# Altium schematic sheet MB1296-Power.SchDoc: Power
size A4; Date: 25-JAN-2017; Organization: STMicroelectronics; Address1: Microcontrollers Division; Address2: 190, avenue Célestin COQ; Address3: 13106 ROUSSET Cedex; Address4: FRANCE; DocumentNumber: MB1296; Revision: D-01; SheetNumber: 2; SheetTotal: 6; Project: STM32 LoRa Discovery
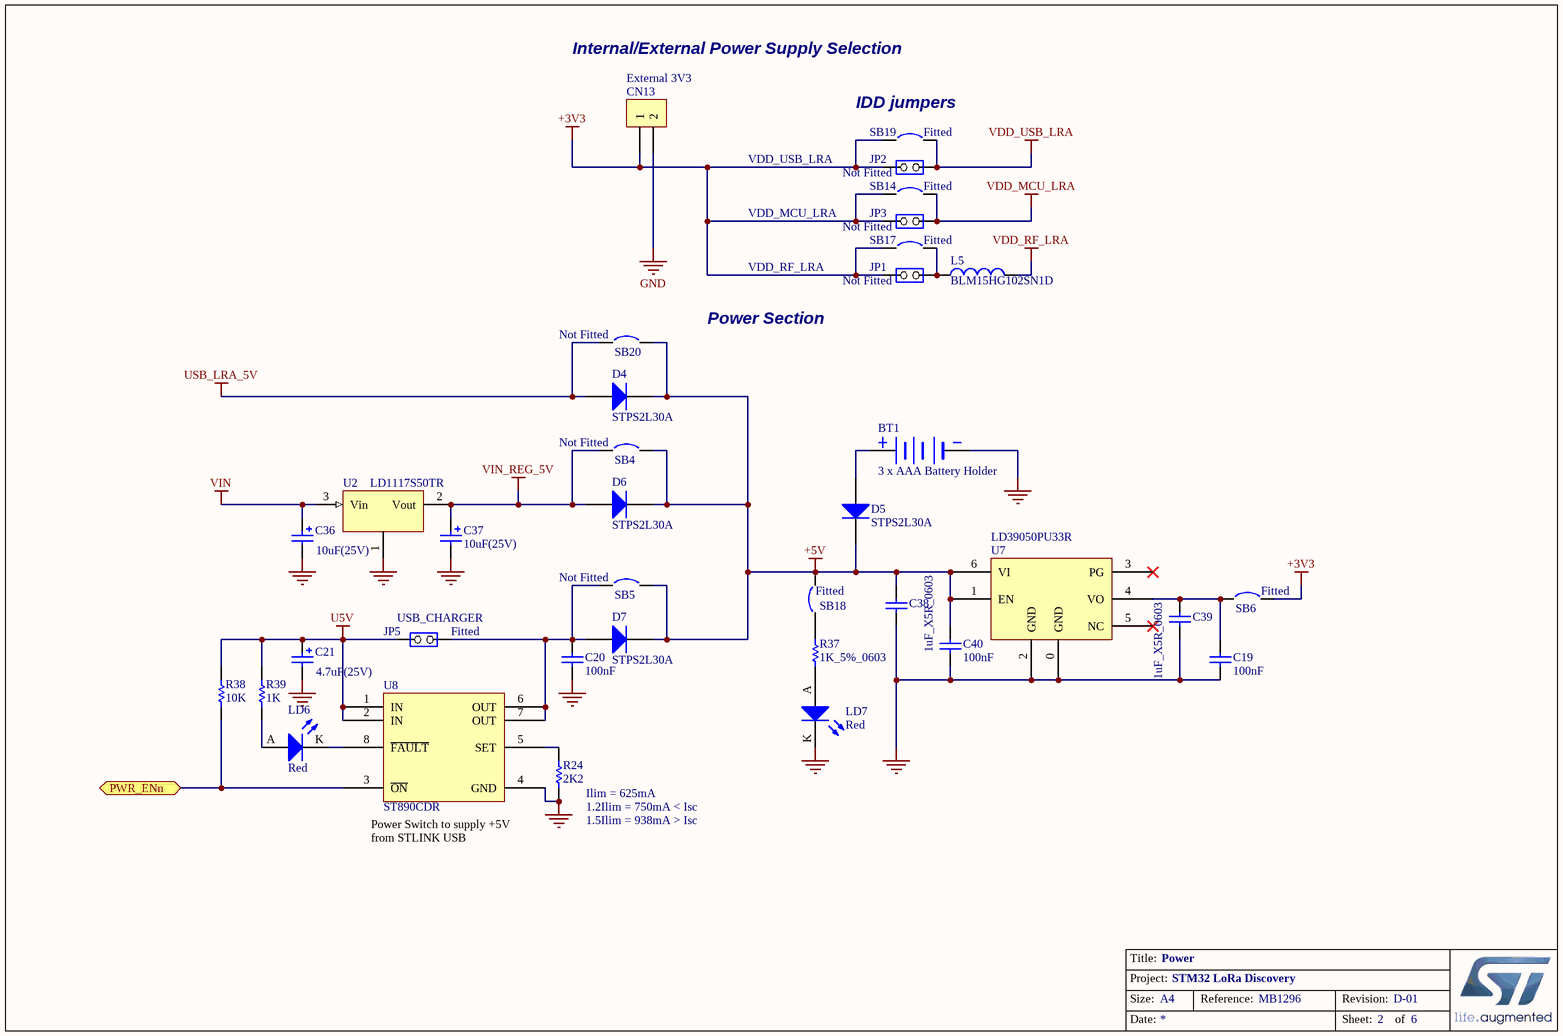
[diagram p0: MB1296-Power.SchDoc]

## Parts
BT1  3 x AAA Battery Holder  [3 X AAA Battery Holder]
C19  100nF  [0603C]
C20  100nF  [0603C]
C21  4.7uF(25V)  [TAN-B]
C36  10uF(25V)  [TAN-B]
C37  10uF(25V)  [TAN-B]
C38  1uF_X5R_0603  [0603C]
C39  1uF_X5R_0603  [0603C]
C40  100nF  [0603C]
CN13  External 3V3  [SIP2]
D4  STPS2L30A  [SMA]
D5  STPS2L30A  [SMA]
D6  STPS2L30A  [SMA]
D7  STPS2L30A  [SMA]
JP1  VDD_RF_LRA  [SIP2/2.54]
JP2  VDD_USB_LRA  [SIP2/2.54]
JP3  VDD_MCU_LRA  [SIP2/2.54]
JP5  USB_CHARGER  [SIP2/2.54]
L5  BLM15HG102SN1D  [0402]
LD6  Red  [0603D]
LD7  Red  [0603D]
R24  2K2  [0603R]
R37  1K_5%_0603  [0603]
R38  10K  [0603R]
R39  1K  [0603R]
SB4  Circuit Breaker  [JP2_SMD]  (value not drawn)
SB5  Circuit Breaker  [JP2_SMD]  (value not drawn)
SB6  Circuit Breaker  [JP2_SMD]  (value not drawn)
SB14  Circuit Breaker  [JP2_SMD]  (value not drawn)
SB17  Circuit Breaker  [JP2_SMD]  (value not drawn)
SB18  Circuit Breaker  [JP2_SMD]  (value not drawn)
SB19  Circuit Breaker  [JP2_SMD]  (value not drawn)
SB20  Circuit Breaker  [JP2_SMD]  (value not drawn)
U2  LD1117S50TR  [SOT-223]
U7  LD39050PU33R  [DFN6(3X3)]
U8  ST890CDR  [SOIC8_1R27_4R9X6]

## Ports
PWR_ENn

## Nets
+3V3: CN13.1 JP1.2(NO) JP2.2(NO) JP3.2(NO) SB6.2 SB14.1 SB17.1 SB19.1
+5V: C38.2 C40.2 D4.2(K) D5.2(K) D6.2(K) D7.2(K) SB4.2 SB5.2 SB18.2 SB20.2 U7.1(EN) U7.6(VI)
GND: BT1.2(-) C19.1 C20.1 C21.2 C36.2 C37.2 C38.1 C39.1 C40.1 CN13.2 LD7.K R24.2 U2.1 U7.0(GND) U7.2(GND) U8.4(GND)
U5V: C21.1 JP5.2(NO) R38.2 R39.2 U8.1(IN) U8.2(IN)
USB_LRA_5V: D4.1(A) SB20.1
VDD_MCU_LRA: JP3.1(COMMON) SB14.2
VDD_RF_LRA: L5.2
VDD_USB_LRA: JP2.1(COMMON) SB19.2
VIN: C36.1 U2.3(Vin)
VIN_REG_5V: C37.1 D6.1(A) SB4.1 U2.2(Vout)
PWR_ENn: R38.1 U8.3(~{ON}) ; port PWR_ENn
NetBT1_1: BT1.1(+) D5.1(A)
NetC19_2: C19.2 C39.2 SB6.1 U7.4(VO)
NetC20_2: C20.2 D7.1(A) JP5.1(COMMON) SB5.1 U8.6(OUT) U8.7(OUT)
NetJP1_1: JP1.1(COMMON) L5.1 SB17.2
NetLD6_A: LD6.A R39.1
NetLD6_K: LD6.K U8.8(~{FAULT})
NetLD7_A: LD7.A R37.1
NetR24_1: R24.1 U8.5(SET)
NetR37_2: R37.2 SB18.1

Not connected (* = marked no-connect by the designer): U7 3(PG)* 5(NC)*

## Notes on the sheet
- Internal/External Power Supply Selection
- (near SB19) IDD jumpers
- (near JP2) Not Fitted
- (near SB19) Fitted
- (near JP3) Not Fitted
- (near SB17) Fitted
- (near SB14) Fitted
- (near JP1) Not Fitted
- (near SB20) Not Fitted
- Power Section
- (near SB4) Not Fitted
- (near SB5) Not Fitted
- (near JP5) Fitted
- (near SB18) Fitted
- (near SB6) Fitted
- Power Switch to supply +5V from STLINK USB
- (near R24) Ilim = 625mA
- (near R24) 1.2Ilim = 750mA < Isc
- (near R24) 1.5Ilim = 938mA > Isc
- Title:
- Project:
- Size:
- Date:
- A4
- Reference:
- Sheet:
- Revision:
- of

## Library data of the parts
BT1 = 3 x AAA Battery Holder: Manufacturer: Keystone; Manufacturer P/N: 2479; Order Code Farnell: *; Order Code RS: *; Order Code Digikey: 36-2479-ND; ECCN_US/UE: *; Fitted: *; Provided by: *; Value: *
C19 C20 C40 = CAP: Capacitor 100nF; Manufacturer: YAGEO; Manufacturer P/N: CC0603KRX7R9BB104; Provided by: Subcon; Revision: July-2002: Re-released for DXP Platform.; Value: 100nF; ECCN_US/UE: *; Fitted: *; Order Code Digikey: *; Order Code Farnell: *; Order Code RS: *
C21 = Cap Pol1: Polarized Capacitor (Radial); Manufacturer: YAGEO; Manufacturer P/N: CC1206KKX7R8BB475; Provided by: Subcon; Revision: July-2002: Re-released for DXP Platform.; Value: 4.7uF; ECCN_US/UE: *; Fitted: *; Order Code Digikey: *; Order Code Farnell: *; Order Code RS: *
C36 C37 = Cap Pol1: Polarized Capacitor (Radial); Manufacturer: AVX; Manufacturer P/N: TAJB106K025R; Provided by: Subcon; Revision: July-2002: Re-released for DXP Platform.; Value: 10uF; ECCN_US/UE: *; Fitted: *; Order Code Digikey: *; Order Code Farnell: *; Order Code RS: *
C38 C39 = CAP SMD 0603  X5R 1µF 25V 10%: 0603  X5R 1µF; Manufacturer: YAGEO; Manufacturer P/N: CC0603KRX5R7BB105; Provided by: Subcon; Order code Farnell: 1288202RL; Value: 1µF; ECCN_US/UE: *; Fitted: *; Order Code Digikey: *
CN13 = Header 2: Manufacturer: Kontek; Manufacturer P/N: 4710334140400; Order Code RS: 423-2835; Provided by: Subcon; Order Code Farnell: *; ECCN_US/UE: *; Fitted: *; Order Code Digikey: *; Value: *
D4-D7 = STPS2L30A: Provided by: STM; Order: BAT60JFILM; ECCN_US/EU: EAR99/NEC; Revision: July-2002: Re-released for DXP Platform.; Manuf_Part_1: BAT60JFILM; Manuf_1: STM; Distrib: ST; Fitted: *; Value: *
JP1-JP3 JP5 = JP2: Manufacturer: Lyconn; Manufacturer P/N: 313140S111116; Fitted: No; Provided by: Subcon; ECCN_US/UE: *; Order Code Digikey: *; Order Code Farnell: *; Order Code RS: *; Value: *
L5 = BLM15HG102SN1D: Manufacturer: Murata Electronics; Manufacturer P/N: BLM15HG102SN1D; Order Code Mouser: 81-BLM15HG102SN1D; ECCN_US/UE: *; Fitted: *; Order Code Digikey: *; Order Code Farnell: *; Order Code RS: *; Provided by: *; Value: *
LD6 LD7 = LED2: Typical RED, GREEN, YELLOW, AMBER GaAs LED; Manufacturer: Everlight; Manufacturer P/N  Green: 19-213SY6C/S530-E2/TR8LED; Manufacturer P/N  Red: 19-213-R6C-AP1Q2B-3T; Revision: July-2002: Re-released for DXP Platform.; ECCN_US/UE: *; Fitted: *; Order Code Digikey: *; Order Code Farnell: *; Order Code RS: *; Provided by: *; Value: *
R24 = Res1_2: Resistor; Manufacturer: YAGEO; Manufacturer P/N: RC0603FR-072K2L; Provided by: Subcon; Value: 2K7; Revision: July-2002: Re-released for DXP Platform.; ECCN_US/UE: *; Fitted: *; Order Code Digikey: *; Order Code Farnell: *; Order Code RS: *
R37 = RES SMD 0603 1K 50V 5% 0.063W: 0603 1K 50V 5% 0.063W; Manufacturer: YAGEO; Manufacturer P/N: RC0603FR-071KL; Order code RS: 461-3818; Provided by: Subcon; Value: 1K; ECCN_US/UE: *; Fitted: *; Order Code Digikey: *
R38 = Resistor_ST: Resistor 0603; Manufacturer: YAGEO; Manufacturer P/N: RC0603JR-0710KL; Provided by: Subcon; Value: 10K; ECCN_US/UE: *; Fitted: *; Order Code Digikey: *; Order Code Farnell: *; Order Code RS: *
R39 = Resistor_ST: Resistor 0603; Manufacturer: YAGEO; Manufacturer P/N: RC0603FR-071KL; Provided by: Subcon; Value: 1K; ECCN_US/UE: *; Fitted: *; Order Code Digikey: *; Order Code Farnell: *; Order Code RS: *
SB4 SB5 SB20 = Circuit Breaker: Fitted: No; Revision: July-2002: Re-released for DXP Platform.; ECCN_US/UE: *; Manufacturer: *; Manufacturer P/N: *; Order Code Digikey: *; Order Code Farnell: *; Order Code RS: *; Provided by: *; Value: *
SB6 SB14 SB17-SB19 = Circuit Breaker: Fitted: Yes; Revision: July-2002: Re-released for DXP Platform.; ECCN_US/UE: *; Manufacturer: *; Manufacturer P/N: *; Order Code Digikey: *; Order Code Farnell: *; Order Code RS: *; Provided by: *; Value: *
U2 = LD1117: Manufacturer: ST; ECCN_US/UE: EAR99/NEC; Provided by: STM; Fitted: *; Manufacturer P/N: LD1117S50TR; Order Code Digikey: *; Order Code Farnell: *; Order Code RS: *; Value: *
U7 = LD39050P: Manufacturer: ST; ECCN_US/UE: EAR99/NEC; Provided by: STM; Fitted: *; Manufacturer P/N: LD39050PU33R; Order Code Digikey: *; Order Code Farnell: *; Order Code RS: *; Value: *
U8 = ST890CDR: Manufacturer: ST; Manufacturer P/N: ST890R; ECCN_US/UE: EAR99/NEC; Provided by: STM; Fitted: *; Order Code Digikey: *; Order Code Farnell: *; Order Code RS: *; Value: *